# EAGLE schematic STorM32 BGC mpu module v008 (EAGLE 6.5.0)
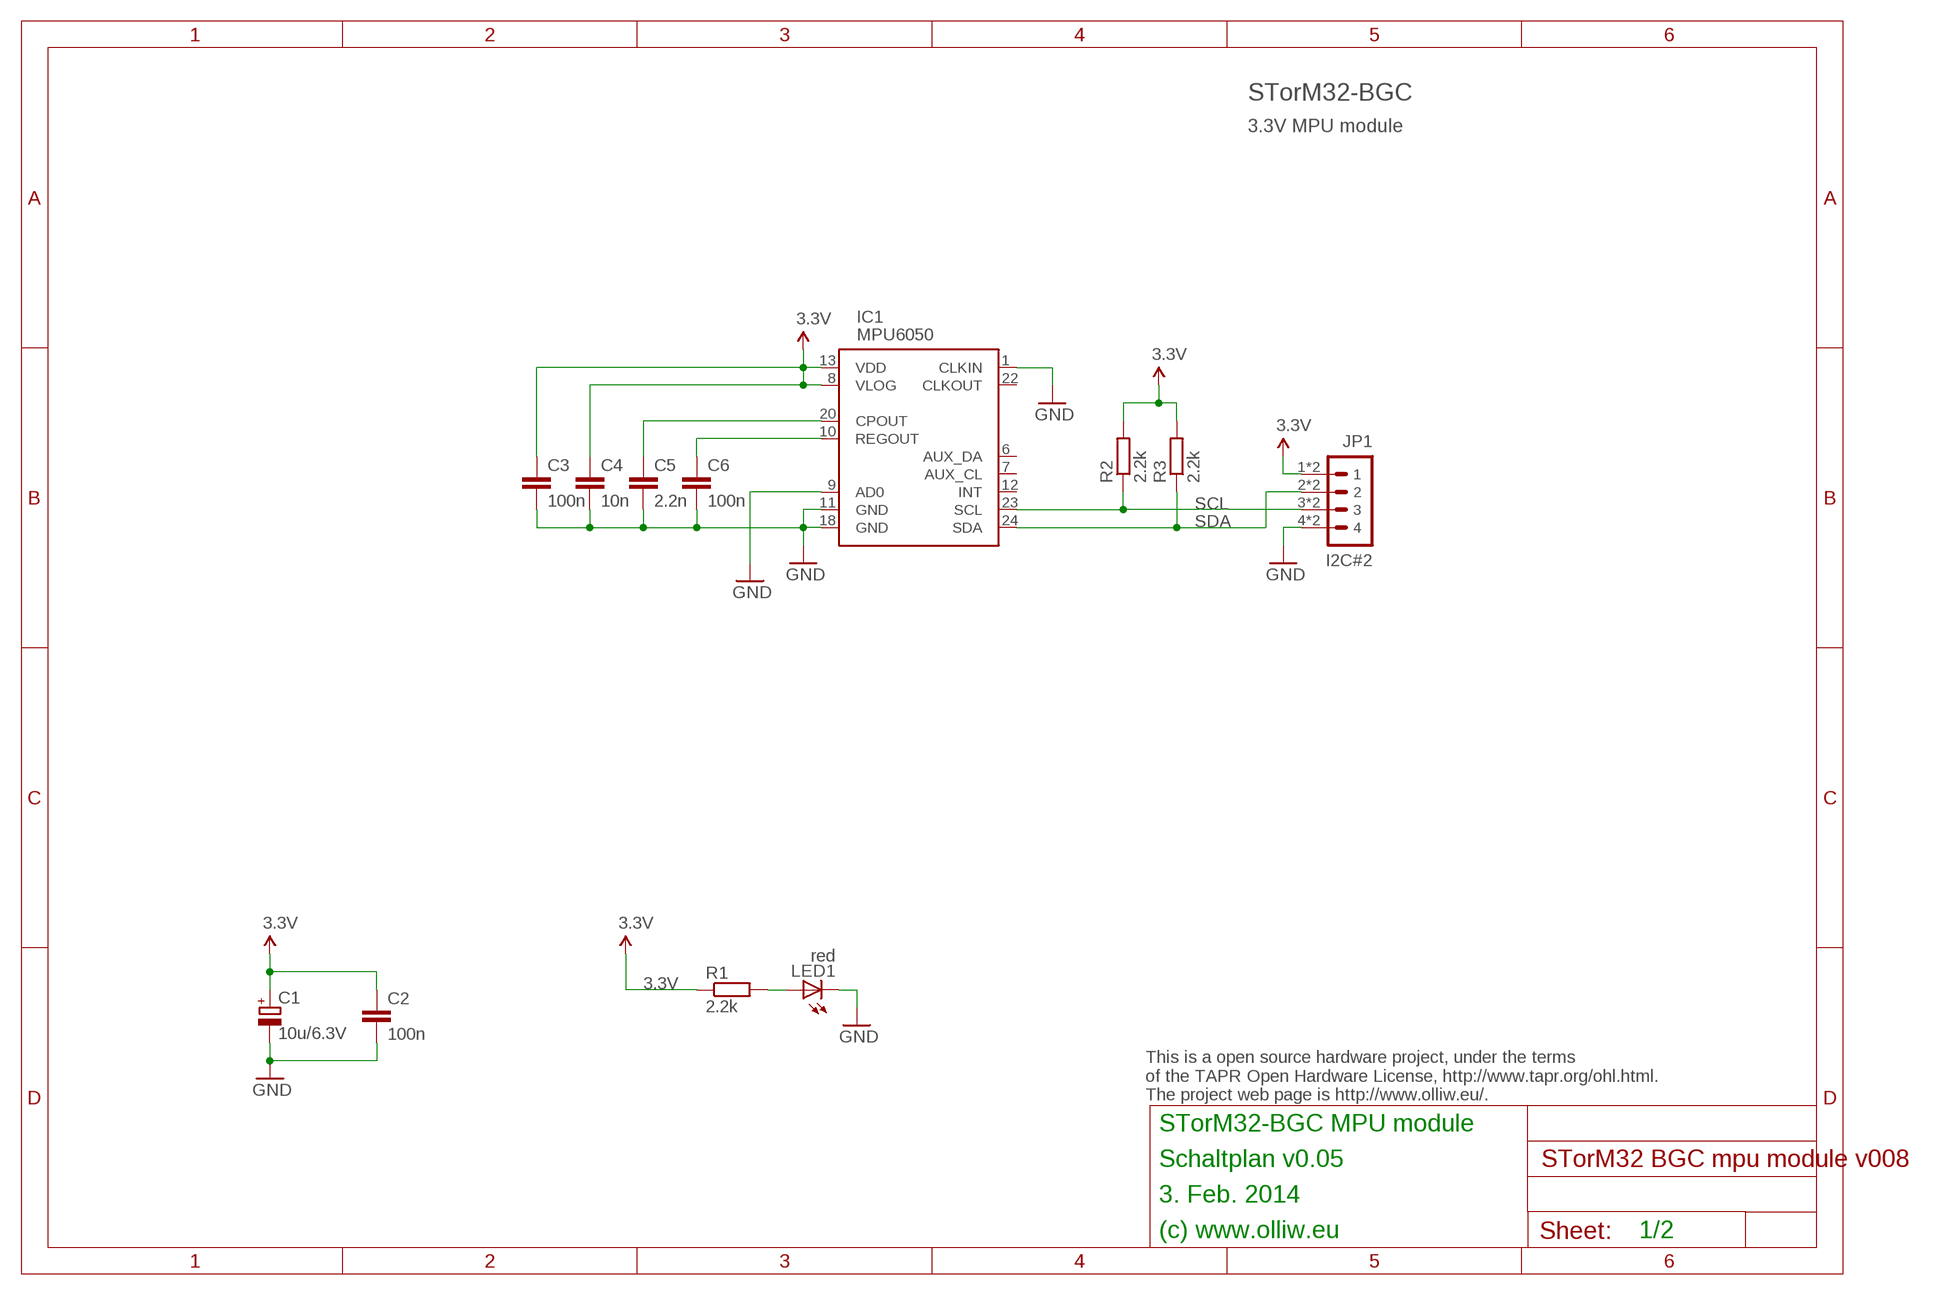
[diagram p0: schematic, sheet 1]

## Parts
C1  10u/6.3V  CPOL-EUSMCB  [SMC_B]
C2  100n  C-EUC0603  [C0603]
C3  100n  C-EUC0603  [C0603]
C4  10n  C-EUC0603  [C0603]
C5  2.2n  C-EUC0603  [C0603]
C6  100n  C-EUC0603  [C0603]
IC1  MPU6050  IMU3000  [QFN-24]
JP1  I2C#2  P4X1_1P27MOLEX-BOTH  [MOLEX-53261-04-SMD-BOTH]
LED1  red  LEDCHIPLED_0603  [CHIPLED_0603]
R1  2.2k  R-EU_R0603  [R0603]
R2  2.2k  R-EU_R0603  [R0603]
R3  2.2k  R-EU_R0603  [R0603]

## Nets
3.3V: C1.+ C2.1 C3.1 C4.1 IC1.8(VLOG) IC1.13(VDD) JP1.1 JP1.5 R1.1 R2.2 R3.2
GND: C1.- C2.2 C3.2 C4.2 C5.2 C6.2 IC1.1(CLKIN) IC1.9(AD0) IC1.11(GND) IC1.18(GND) JP1.4 JP1.8 LED1.C
N$9: LED1.A R1.2
N$20: C6.1 IC1.10(REGOUT)
N$24: C5.1 IC1.20(CPOUT)
SCL: IC1.23(SCL) JP1.3 JP1.7 R2.1
SDA: IC1.24(SDA) JP1.2 JP1.6 R3.1
Unconnected: IC1.6(AUX_DA) IC1.7(AUX_CL) IC1.12(INT) IC1.22(CLKOUT)

## Notes on the sheet
- STorM32-BGC
- 3.3V MPU module
- This is a open source hardware project, under the terms
  of the TAPR Open Hardware License, http://www.tapr.org/ohl.html.
  The project web page is http://www.olliw.eu/.
- STorM32-BGC MPU module
- Schaltplan v0.05
- 3. Feb. 2014
- (c) www.olliw.eu | 1/2

## Library data of the parts
C1 = rcl:CPOL-EU: POLARIZED CAPACITOR, European symbol
C2-C6 = rcl:C-EU: CAPACITOR, European symbol
IC1 = # SparkFun2:IMU3000
JP1 = # stdlib:P4X1_1P27
LED1 = led:LED: LED OSRAM: - CHIPLED LG R971, LG N971, LY N971, LG Q971, LY Q971, LO R971, LY R971 LH N974, LH R974 LS Q976, LO Q976, LY Q976 LO Q996 - Hyper CHIPLED LW Q18S LB Q993, LB Q99A, LB R99A - SideLED LS A670, LO A670, LY A670, LG A670, LP A670 LB A673, LV A673, LT A673, LW A673 LH A674 LY A675 LS A676, LA A676, LO A676, LY A676, LW A676 LS A679, LY A679, LG A679 - Hyper Micro SIDELED® LS Y876, LA Y876, LO Y876, LY Y876 LT Y87S - SmartLED LW L88C, LW L88S LB L89C, LB L89S, LG L890 LS L89K, LO L89K, LY L89K LS L896, LA L896, LO L896, LY L896 - TOPLED LS T670, LO T670, LY T670, LG T670, LP T670 LSG T670, LSP T670, LSY T670, LOP T670, LYG T670 LG T671, LOG T671, LSG T671 LB T673, LV T673, LT T673, LW T673 LH T674 LS T676, LA T676, LO T676, LY T676, LB T676, LH T676, LSB T676, LW T676 LB T67C, LV T67C, LT T67C, LS T67K, LO T67K, LY T67K, LW E67C LS E67B, LA E67B, LO E67B, LY E67B, LB E67C, LV E67C, LT E67C LW T67C LS T679, LY T679, LG T679 LS T770, LO T770, LY T770, LG T770, LP T770 LB T773, LV T773, LT T773, LW T773 LH T774 LS E675, LA E675, LY E675, LS T675 LS T776, LA T776, LO T776, LY T776, LB T776 LHGB T686 LT T68C, LB T68C - Hyper Mini TOPLED® LB M676 - Mini TOPLED Santana® LG M470 LS M47K, LO M47K, LY M47K Source: http://www.osram.convergy.de LUXEON: - LUMILED® LXK2-PW12-R00, LXK2-PW12-S00, LXK2-PW14-U00, LXK2-PW14-V00 LXK2-PM12-R00, LXK2-PM12-S00, LXK2-PM14-U00 LXK2-PE12-Q00, LXK2-PE12-R00, LXK2-PE12-S00, LXK2-PE14-T00, LXK2-PE14-U00 LXK2-PB12-K00, LXK2-PB12-L00, LXK2-PB12-M00, LXK2-PB14-N00, LXK2-PB14-P00, LXK2-PB14-Q00 LXK2-PR12-L00, LXK2-PR12-M00, LXK2-PR14-Q00, LXK2-PR14-R00 LXK2-PD12-Q00, LXK2-PD12-R00, LXK2-PD12-S00 LXK2-PH12-R00, LXK2-PH12-S00 LXK2-PL12-P00, LXK2-PL12-Q00, LXK2-PL12-R00 Source: www.luxeon.com KINGBRIGHT: KA-3528ASYC Source: www.kingbright.com
R1-R3 = rcl:R-EU_: RESISTOR, European symbol